# Altium project TTC_PCBEvalBoard.PrjPcb
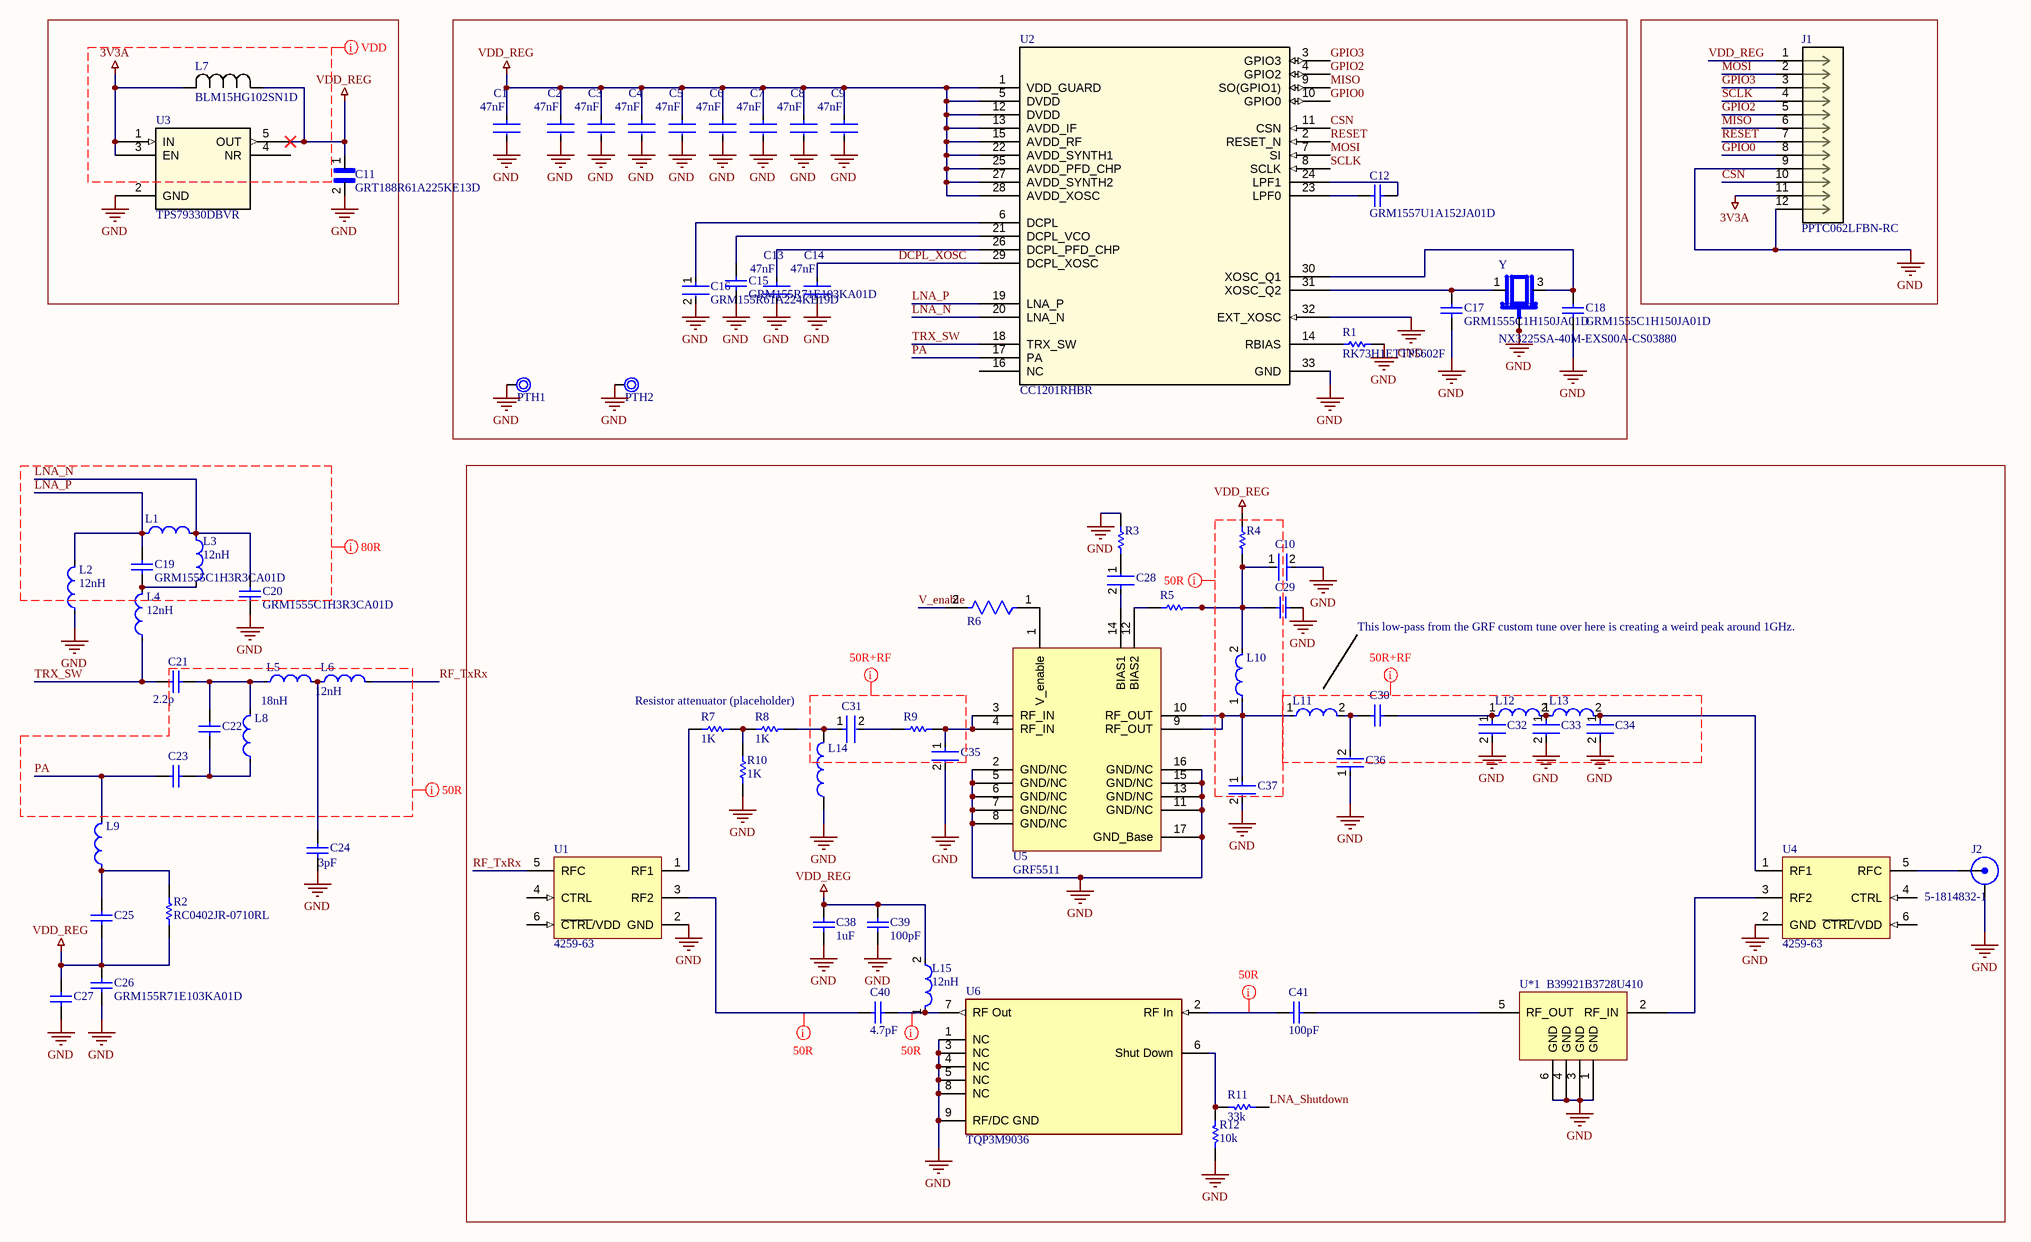
[diagram p0: CC1201EvalBoard.SchDoc]
1 sheet, 80 parts. Net scope: global (net labels, ports and power ports of the same name join across sheets).
Board file: CC1201EvalBoard.PcbDoc

## Sheet CC1201EvalBoard.SchDoc: UVSD CC1201 Evaluation Board
size C; SheetNumber: 1; SheetTotal: 1

### Parts
C1  Capacitance: 47nF  [FP-GRM155-0_05-MFG]  (hidden comment: GRM155R71E473KA88D)
C2  Capacitance: 47nF  [FP-GRM155-0_05-MFG]  (hidden comment: GRM155R71E473KA88D)
C3  Capacitance: 47nF  [FP-GRM155-0_05-MFG]  (hidden comment: GRM155R71E473KA88D)
C4  Capacitance: 47nF  [FP-GRM155-0_05-MFG]  (hidden comment: GRM155R71E473KA88D)
C5  Capacitance: 47nF  [FP-GRM155-0_05-MFG]  (hidden comment: GRM155R71E473KA88D)
C6  Capacitance: 47nF  [FP-GRM155-0_05-MFG]  (hidden comment: GRM155R71E473KA88D)
C7  Capacitance: 47nF  [FP-GRM155-0_05-MFG]  (hidden comment: GRM155R71E473KA88D)
C8  Capacitance: 47nF  [FP-GRM155-0_05-MFG]  (hidden comment: GRM155R71E473KA88D)
C9  Capacitance: 47nF  [FP-GRM155-0_05-MFG]  (hidden comment: GRM155R71E473KA88D)
C10  GRM155R71C104KA88D  [MURATA_C0402]  (value not drawn)
C11  GRT188R61A225KE13D  [CAPC1608X9N]
C12  GRM1557U1A152JA01D  [CAPC1005X55X25ML05T10]
C13  Capacitance: 47nF  [FP-GRM155-0_05-MFG]  (hidden comment: GRM155R71E473KA88D)
C14  Capacitance: 47nF  [FP-GRM155-0_05-MFG]  (hidden comment: GRM155R71E473KA88D)
C15  GRM155R71E103KA01D  [CAPC1005X55X25LL05T10]
C16  GRM155R61A224KE19D  [FP-GRM155-0_05-IPC_C]
C17  GRM1555C1H150JA01D  [CAPC1005X55X25LL05T10]
C18  GRM1555C1H150JA01D  [CAPC1005X55X25LL05T10]
C19  GRM1555C1H3R3CA01D  [CAPC1005X55X25NL5T10]
C20  GRM1555C1H3R3CA01D  [CAPC1005X55X25NL5T10]
C21  value 2.2p  [CAPC1005X55X25ML05T10]  (hidden comment: GRM1555C1H2R2CA01D)
C22  GRM1555C1H1R0BA01D  [CAPC1005X55X25LL05T10]  (value not drawn)
C23  GRM1555C1H150JA01D  [CAPC1005X55X25LL05T10]  (value not drawn)
C24  value 3pF  [CAPC1005X55X25LL05T10]  (hidden comment: GRM1555C1H3R0CA01D)
C25  GRM1555C1H330JA01D  [CAPC1005X55X25ML05T10]  (value not drawn)
C26  GRM155R71E103KA01D  [CAPC1005X55X25LL05T10]
C27  GRM1555C1H101JA01D  [CAPC1005X55X25ML05T10]  (value not drawn)
C28  GRM155R71C104KA88D  [MURATA_C0402]  (value not drawn)
C29  GRM1555C1H101JA01D  [MURATA_C0402]  (value not drawn)
C30  GRM1555C1H101JA01D  [MURATA_C0402]  (value not drawn)
C31  GRM155R70G105KA12D  [MURATA_C0402]  (value not drawn)
C32  GJM1555C1H3R9CB01D  [FP-GJM155-0_05-IPC_C]  (value not drawn)
C33  GJM1555C1H6R8WB01D  [FP-GJM155-0_05-IPC_B]  (value not drawn)
C34  GJM1555C1H3R9CB01D  [FP-GJM155-0_05-IPC_C]  (value not drawn)
C35  GJM1555C1HR30WB01D  [MURATA_C0402]  (value not drawn)
C36  GJM1555C1H4R7CB01D  [MURATA_C0402]  (value not drawn)
C37  GJM1555C1H1R5BB01D  [MURATA_C0402]  (value not drawn)
C38  1uF  [CAPC1005X56X25LL10T15]
C39  100pF  [CAPC1005X56X25LL10T15]
C40  4.7pF  [CAPC1005X56X25LL10T15]
C41  100pF  [CAPC1005X56X25LL10T15]
J1  PPTC062LFBN-RC  [CONN12_878311241_MOL]
J2  5-1814832-1  [TE_5-1814832-1]
L1  LQW15AN15NJ00D  [FP-LQW15AN_00-W0_6-0_1-MFG]  (value not drawn)
L2  value 12nH  [FP-LQW15AN_00-W0_6-0_1-MFG]  (hidden comment: LQW15AN12NJ00D)
L3  value 12nH  [FP-LQW15AN_00-W0_6-0_1-MFG]  (hidden comment: LQW15AN12NJ00D)
L4  value 12nH  [FP-LQW15AN_00-W0_6-0_1-MFG]  (hidden comment: LQW15AN12NJ00D)
L5  Inductance: 18nH  [FP-LQW15AN_00-W0_6-0_1-MFG]  (hidden comment: LQW15AN18NJ00D)
L6  value 12nH  [FP-LQW15AN_00-W0_6-0_1-MFG]  (hidden comment: LQW15AN12NJ00D)
L7  BLM15HG102SN1D  [IND_BLM15_0402_MUR - NO_KEEPOUT]
L8  LQW15AN7N5G00D  [FP-LQW15AN_00-W0_6-0_1-MFG]  (value not drawn)
L9  LQW15AN10NJ00D  [FP-LQW15AN_00-W0_6-0_1-MFG]  (value not drawn)
L10  LQW15AN18NJ00D  [MURATA_L0402_LQW]  (value not drawn)
L11  LQW15AN3N6C10D  [MURATA_L0402_LQW]  (value not drawn)
L12  LQW15AN12NG00D  [FP-LQW15AN_00-W0_6-0_1-MFG]  (value not drawn)
L13  LQW15AN12NG00D  [FP-LQW15AN_00-W0_6-0_1-MFG]  (value not drawn)
L14  LQP15MN8N2B02D  [MURATA_L0402_LQP]  (value not drawn)
L15  12nH  [FP-LQW18AN_80-MFG]
PTH1  PTH  [M3 Mounting Hole]  (value not drawn)
PTH2  PTH  [M3 Mounting Hole]  (value not drawn)
R1  RK73H1ETTP5602F  [RESC1005X40X25NL10T10]
R2  RC0402JR-0710RL  [RESC1005X40X25NL05T10]
R3  RC0402FR-07300RL  [Yageo_0402]  (value not drawn)
R4  RC0402JR-130RL  [Yageo_0402]  (value not drawn)
R5  RC0402FR-07130RL  [Yageo_0402]  (value not drawn)
R6  AC0402FR-07820RL  [Yageo_0402]  (value not drawn)
R7  value 1K  (hidden comment: Resistor)
R8  value 1K  (hidden comment: Resistor)
R9  RC0402FR-077R5L  [Yageo_0402]  (value not drawn)
R10  value 1K  (hidden comment: Resistor)
R11  33k  [RESC1005X40X25ML05T10]
R12  10k  [RESC1005X40X25ML05T10]
U1  4259-63  [PERE-SC-70-6_M]
U2  CC1201RHBR  [RHB32_3P45X3P45_TEX]
U3  TPS79330DBVR  [DBV5_TEX]  (no BOM)
U4  4259-63  [PERE-SC-70-6_M]
U5  GRF5511  [QFN50P300X300X100_HS-17N]
U6  TQP3M9036  [FP-TQP3M9036-MFG]
U*1  B39921B3728U410
Y  NX3225SA-40M-EXS00A-CS03880  [OSCCC320X250X60]

### Blocks framed on the sheet
Resistor attenuator (placeholder): C10 C28-C41 J2 L10-L15 R3-R12 U1 U4-U6 U*1

### Nets
3V3A: J1.11 L7.2 U3.1(IN) U3.3(EN)
GND: C1.2 C2.2 C3.2 C4.2 C5.2 C6.2 C7.2 C8.2 C9.2 C10.2 C11.2 C13.2 C14.2 C15.1 C16.2 C17.1 C18.1 C20.1 C24.1 C26.1 C27.1 C29.2 C32.2 C33.2 C34.2 C35.2 C36.1 C37.2 C38.2 C39.2 J1.9 J1.12 J2.2,3,4,5(GND) L2.1 L14.1 PTH1.1 PTH2.1 R1.2 R3.2 R10.1 R12.1 U1.2(GND) U2.32(EXT_XOSC) U2.33(GND) U3.2(GND) U4.2(GND) U5.2(GND/NC) U5.5(GND/NC) U5.6(GND/NC) U5.7(GND/NC) U5.8(GND/NC) U5.11(GND/NC) U5.13(GND/NC) U5.15(GND/NC) U5.16(GND/NC) U5.17(GND_Base) U6.1(NC) U6.3(NC) U6.4(NC) U6.5(NC) U6.8(NC) U6.9(RF/DC_GND) U*1.1(GND) U*1.3(GND) U*1.4(GND) U*1.6(GND) Y.2(GND) Y.4(GND)
VDD_REG: C1.1 C2.1 C3.1 C4.1 C5.1 C6.1 C7.1 C8.1 C9.1 C11.1 C25.1 C26.2 C27.2 C38.1 C39.1 J1.1 L7.1 L15.2 R2.1 R4.2 U2.1(VDD_GUARD) U2.5(DVDD) U2.12(DVDD) U2.13(AVDD_IF) U2.15(AVDD_RF) U2.22(AVDD_SYNTH1) U2.25(AVDD_PFD_CHP) U2.27(AVDD_SYNTH2) U2.28(AVDD_XOSC) U3.5(OUT)
CSN: J1.10 U2.11(CSN)
DCPL_XOSC: C14.1 U2.29(DCPL_XOSC)
GPIO0: J1.8 U2.10(GPIO0)
GPIO2: J1.5 U2.4(GPIO2)
GPIO3: J1.3 U2.3(GPIO3)
LNA_N: C20.2 L1.2 L3.1 U2.20(LNA_N)
LNA_P: C19.2 L1.1 L2.2 U2.19(LNA_P)
LNA_Shutdown: R11.2
MISO: J1.6 U2.9(SO(GPIO1))
MOSI: J1.2 U2.7(SI)
PA: C23.1 L9.2 U2.17(PA)
RESET: J1.7 U2.2(RESET_N)
RF_TxRx: L6.2 U1.5(RFC)
SCLK: J1.4 U2.8(SCLK)
TRX_SW: C21.1 L4.1 U2.18(TRX_SW)
V_enable: R6.2
NetC10_1: C10.1 C29.1 L10.2 R4.1 R5.2
NetC12_1: C12.1 U2.23(LPF0)
NetC12_2: C12.2 U2.24(LPF1)
NetC13_1: C13.1 U2.26(DCPL_PFD_CHP)
NetC15_2: C15.2 U2.21(DCPL_VCO)
NetC16_1: C16.1 U2.6(DCPL)
NetC17_2: C17.2 U2.31(XOSC_Q2) Y.1
NetC18_2: C18.2 U2.30(XOSC_Q1) Y.3
NetC19_1: C19.1 L3.2 L4.2
NetC21_2: C21.2 C22.2 L5.1 L8.2
NetC22_1: C22.1 C23.2 L8.1
NetC24_2: C24.2 L5.2 L6.1
NetC25_2: C25.2 L9.1 R2.2
NetC28_1: C28.1 R3.1
NetC28_2: C28.2 U5.14(BIAS1)
NetC30_1: C30.1 C36.2 L11.2
NetC30_2: C30.2 C32.1 L12.1
NetC31_1: C31.1 L14.2 R8.2
NetC31_2: C31.2 R9.1
NetC33_1: C33.1 L12.2 L13.1
NetC34_1: C34.1 L13.2 U4.1(RF1)
NetC35_1: C35.1 R9.2 U5.3(RF_IN) U5.4(RF_IN)
NetC37_1: C37.1 L10.1 L11.1 U5.9(RF_OUT) U5.10(RF_OUT)
NetC40_1: C40.1 L15.1 U6.7(RF_Out)
NetC40_2: C40.2 U1.3(RF2)
NetC41_1: C41.1 U*1.5(RF_OUT)
NetC41_2: C41.2 U6.2(RF_In)
NetJ2_1: J2.1 U4.5(RFC)
NetR1_1: R1.1 U2.14(RBIAS)
NetR5_1: R5.1 U5.12(BIAS2)
NetR6_1: R6.1 U5.1(V_enable)
NetR7_1: R7.1 U1.1(RF1)
NetR7_2: R7.2 R8.1 R10.2
NetR11_1: R11.1 R12.2 U6.6(Shut_Down)
NetU4_3: U4.3(RF2) U*1.2(RF_IN)

Not connected (* = marked no-connect by the designer): U1 4(CTRL) 6(~{CTRL}/VDD); U2 16(NC); U3 4(NR); U4 4(CTRL) 6(~{CTRL}/VDD)

### Layout directives
net class 50R: (no net found under the mark), NetC40_1, NetC40_2, NetC41_2, PA
net class 80R: LNA_N, LNA_P
net class VDD: 3V3A
rule Width Constraint [Pref Impedance = 50.00ohms    Min Impedance = 50.00ohms    Max Impedance = 50.00ohms]; net class RF_Main_Line: (no net found under the mark), GND

### Notes on the sheet
- This low-pass from the GRF custom tune over here is creating a weird peak around 1GHz.
- DWG. NO.
- REV.
- SHT.
- THIS DOCUMENT AND THE DATA DISCLOSED HEREIN OR HEREWITH IS THE PROPERTY OF ALTIUM LIMITED AND MAY BE FREELY DISTRIBUTED IN WHOLE. NO RIGHTS ARE RESERVED OR EXPRESS OR IMPLIED WARANTEE GIVEN.
- REVISION
- DESCRIPTION
- DATE
- APPROVED
- ENG:
- APPROVALS
- PROJECT
- DSN:
- CHK:
- REFERENCE DOCUMENTS
- PROJECT REVISION:
- TITLE
- DOCUMENT REVISION:
- DESIGN ITEM:
- BOM:
- FAB DWG:
- PCB DWG:
- ASSY DWG:
- SCALE:
- SIZE
- B
- CAGE CODE
- FILE NAME
- DWG NO.
- SHEET
- OF
- REV

### Library data of the parts
C1-C9 C13 C14 = CMP-2008-04630-5: Chip Multilayer Ceramic Capacitors for General Purpose, 0402, 47000pF, X7R, 15%, 10%, 25V; Depth: 0.5mm; Case/Package: 0402; Tolerance: 10%; REACH SVHC: No SVHC; Termination: SMD/SMT; Number of Pins: 2; Mount: Surface Mount; Radiation Hardening: No; Height: 0.5mm; Min Operating Temperature: -55°C; Max Operating Temperature: 125°C; Thickness: 0.022inch; Length: 1mm; Voltage Rating (DC): 25V; Material: Ceramic; Lead Free: Lead Free; Packaging: Tape and Reel; Dielectric: X7R; Voltage: 25V; Case Code (Metric): 1005; Width: 0.02inch; Case Code (Imperial): 0402; Voltage Rating: 25V; Package Quantity: 1
C10 C28 = CMP-2100-03641-2: CAP CER 0.1UF 16V X7R 0402; Manufacturer: Murata; Standoff Height: 0mm; Tolerance: 10%; Voltage Rating: 16Vdc; Material: Ceramic; Capacitance: 0.10μF; Value: 0.10μF; RoHS: TRUE; Manufacturer Part Number: GRM155R71C104KA88D; Temperature Characteristic: X7R; Octopart: https://octopart.com/grm155r71c104ka88d-murata-196880; Digikey Description: CAP CER 0.1UF 16V X7R 0402; Device Class L3: Ceramic Capacitors; Height: 0.55mm; ComponentLink2Description: Datasheet; Temperature Range Low: -55°C; Ipc Land Pattern Name: CAPC10050X219; ComponentLink2URL: https://search.murata.co.jp/Ceramy/image/img/A01X/G101/ENG/GRM155R71H471KA01-01A.pdf; Device Class L1: Passive Components; Lead Free: yes; Category: Cap; Package: GRM15; Temperature: -55°C to +125°C; Device Class L2: Capacitors; Temperature Range High: +125°C; Mouser Description: 0402 0.1 uF 16V ±10 % Tolerance X7R SMT Multilayer Ceramic Capacitor
C11 = GRT188R61A225KE13D: CAP CER 2.2UF 10V X5R 0603; Package: None; Price: None; Value: *; MP: GRT188R61A225KE13D; Availability: Unavailable
C12 = CMP-2008-04484-1: Manufacturer: Murata; Part Number: GRM1557U1A152JA01D
C15 C26 = CMP-1034-01880-2: Manufacturer: Murata; Part Number: GRM155R71E103KA01D
C16 = CMP-2008-04561-5: CAP CER 0.22UF 10V X5R 0402; Tolerance: 10%; Capacitance: 220nF; Material: Ceramic; Insulation Resistance: 10GR; Package Quantity: 1; Termination: SMD/SMT; Max Operating Temperature: 85°C; Voltage: 10V; REACH SVHC: No SVHC; Thickness: 0.022inch; Mount: Surface Mount; Height: 0.5mm; Length: 1mm; Lead Free: Lead Free; Number of Pins: 2; Case Code (Imperial): 0402; Case/Package: 0402; Min Operating Temperature: -55°C; Packaging: Tape and Reel; Dielectric: X5R; Depth: 0.5mm; Series: GRM; Case Code (Metric): 1005; Radiation Hardening: No; RoHS Compliant: Yes; Voltage Rating (DC): 10V; Voltage Rating: 10V; Dielectric Material: Ceramic; Width: 0.5mm
C17 C18 C23 = CMP-2008-04266-1: Manufacturer: Murata; Part Number: GRM1555C1H150JA01D
C19 C20 = CMP-1034-00264-3: Chip Capacitor, 3.3 pF, +/- 0.25 pF, 50 V, -55 to 125 degC, 0402 (1005 Metric), RoHS, Tape and Reel; Type (Capacitors): C0G; Voltage Rating: 50 V; Capacitance: 3.3 pF; PartNumber: GRM1555C1H3R3CA01D; Package Quantity: 10000; Mounting Technology: Surface Mount; Case Code (Metric): 1005; ComponentLink1Description: Manufacturer URL; PackageDescription: 2-Pin Surface Mount Device, Body 1 x 0.5 mm; Length: 0.039 inch; RoHSCompliant: true; ComponentLink1URL: http://www.murata.com/; Height: 0.5 mm; Max Operating Temperature: 125 degC; REACH SVHC: No SVHC; ComponentLink2URL: http://search.murata.co.jp/Ceramy/image/img/A01X/G101/ENG/GRM1555C1H3R3CA01-01.pdf; Width: 0.02 inch; Mount: Surface Mount; Min Operating Temperature: -55 degC; Case Code (Imperial): 0402; Case/Package: 0402; Radiation Hardening: No; Voltage Rating (DC): 50 V; ComponentLink2Description: Datasheet; Packaging: Tape and Reel; DatasheetVersion: 03/2016
C21 = CMP-2008-03920-1: Manufacturer: Murata; Part Number: GRM1555C1H2R2CA01D
C22 = CMP-2008-03925-1: Manufacturer: Murata; Part Number: GRM1555C1H1R0BA01D
C24 = CMP-2008-04347-1: Manufacturer: Murata; Part Number: GRM1555C1H3R0CA01D
C25 = CMP-2008-03913-1: Manufacturer: Murata; Part Number: GRM1555C1H330JA01D
C27 C29 C30 = CMP-2008-03915-1: Manufacturer: Murata; Part Number: GRM1555C1H101JA01D
C31 = CMP-2008-04585-2: Chip Multilayer Ceramic Capacitors for General Purpose, 0402, 1.0uF, X7R, 15%, 10%, 4V; Capacitance: 1uF; REACH SVHC: No SVHC; Thickness: 0.022inch; Lead Free: Lead Free; Case Code (Imperial): 0402; Weight: 0.000212oz; Case Code (Metric): 1005; Mount: Surface Mount; Height: 0.5mm; Depth: 0.5mm; Tolerance: 10%; Voltage Rating (DC): 4V; Voltage Rating: 4V; Resistor Type: Ceramic; Case/Package: 0402; Max Operating Temperature: 125°C; Packaging: Tape and Reel; Min Operating Temperature: -55°C; Termination: SMD/SMT; Package Quantity: 10000; Voltage: 4V; Dielectric: X7R; Width: 0.02inch; Length: 1mm
C32 C34 = CMP-2008-03853-2: Multi-Layer Ceramic Capacitor 3.9pF C0G  ±0.25pF 0402 Paper T/R; Voltage Rating (DC): 50V; Packaging: Tape and Reel; Case Code (Metric): 1005; Max Operating Temperature: 125°C; Case/Package: 0402; Length: 1mm; Radiation Hardening: No; Min Operating Temperature: -55°C; Case Code (Imperial): 0402; Lead Free: Lead Free; Package Quantity: 1; Dielectric: C0G; Thickness: 0.022inch; Voltage: 50V; Capacitance: 3.9pF; Termination: SMD/SMT; Mount: Surface Mount; Voltage Rating: 50V; Depth: 0.5mm; Width: 0.02inch; Height: 0.5mm
C33 = CMP-06035-049612-1: Multi-Layer Ceramic Capacitor 6.8pF C0G  ±0.05pF 0402 Paper T/R; Voltage Rating (DC): 50V; Dielectric: C0G; Length: 1mm; Capacitance: 6.8pF; Thickness: 500um; Width: 500um
C35 = CMP-2008-03901-2: Multi-Layer Ceramic Capacitor 0.3pF C0G  ±0.05pF 0402 Paper T/R; Voltage Rating (DC): 50V; Packaging: Tape and Reel; Length: 1mm; Min Operating Temperature: -55°C; Case Code (Metric): 1005; Package Quantity: 10000; Termination: SMD/SMT; Height: 0.5mm; Dielectric: C0G; Case Code (Imperial): 0402; Mount: Surface Mount; Max Operating Temperature: 125°C; Thickness: 0.022inch; Radiation Hardening: No; Voltage Rating: 50V; Lead Free: Lead Free; Depth: 0.5mm; Case/Package: 0402; Capacitance: 0.3pF; Width: 0.02inch
C36 = CMP-2008-03859-2: Multi-Layer Ceramic Capacitor 4.7pF C0G  ±0.25pF 0402 Paper T/R; Voltage Rating (DC): 50V; Temperature Coefficient: 30ppm/°C; Case/Package: 0402; Packaging: Tape and Reel; Package Quantity: 10000; Depth: 0.5mm; REACH SVHC: No SVHC; Height: 0.5mm; Lead Free: Lead Free; Number of Pins: 2; Case Code (Imperial): 0402; Width: 0.02inch; Max Operating Temperature: 125°C; Capacitance: 4.7pF; Dielectric: C0G; Lead Pitch: 0.3mm; Voltage Rating: 50V; Min Operating Temperature: -55°C; Thickness: 0.022inch; Voltage: 50V; Radiation Hardening: No; Mount: Surface Mount; Termination: SMD/SMT; Case Code (Metric): 1005; Length: 1mm
C37 = CMP-2008-03820-2: Multi-Layer Ceramic Capacitor 1.5pF C0G  ±0.1pF 0402 Paper T/R; Temperature Coefficient: 30ppm/°C; Voltage Rating: 50V; Depth: 0.5mm; Case Code (Imperial): 0402; Package Quantity: 10000; Length: 1mm; Number of Pins: 2; Max Operating Temperature: 125°C; Mount: Surface Mount; Construction: Flat; Thickness: 0.022inch; Series: GJM; Packaging: Tape and Reel; Radiation Hardening: No; REACH SVHC: No SVHC; Case/Package: 0402; Lead Free: Lead Free; Voltage Rating (DC): 50V; Min Operating Temperature: -55°C; Dielectric: C0G; Termination: SMD/SMT; Width: 0.5mm; Capacitance: 1.5pF; Lead Pitch: 0.3mm; Case Code (Metric): 1005; Voltage: 50V; Height: 0.5mm
C38-C41 = CMP-2008-02462-1: Part Number: 04023A101FAT2A; Manufacturer: AVX Interconnect / Elco
J2 = 11151: CONN SMA JACK STR 50 OHM PCB; Part_Type: Connector; Manufacturer: TE Connectivity; Part_Status: Production; ID: 11151; Updated By: cfar001; Sorted_Value: 0; Voltage_Rating: 500V; Value: 5-1814832-1; Manufacturer Part Number: 5-1814832-1; Manufacturer Part Description: CONN SMA JACK STR 50 OHM PCB; Supplier 1: Digi-Key; Supplier Part Number 1: A97594-ND; RoHS: Yes; Created By: cfar001; Created_Date: 2024-07-04 15:58:01; Updated_Date: 2024-08-12 13:05:25; ComponentLink1Description: Datasheet; ComponentLink1URL: https://mm.digikey.com/Volume0/opasdata/d220001/medias/docus/10/1814832.pdf; ComponentLink2Description: Supplier Part Details; ComponentLink2URL: https://www.digikey.ca/en/products/detail/te-connectivity-amp-connectors/5-1814832-1/1755982; Symbol Ref: 5-1814832-1; MP: 5-1814832-1; Package: None; Availability: Unavailable; Price: None; Sub_Type: SMA
L1 = CMP-2000-06595-2: Wire Wound RF Inductor 15nH ±5% 460mA 0.16Ω 0402 (1005); Test Frequency: 100MHz; DC Resistance (DCR): 160mR; Shielding: Unshielded; Q Factor: 30; Core Material: Air; Self Resonant Frequency: 5GHz; Resistor Type: Wirewound; DC Current: 460mA; Inductance: 15nH; Weight: 2.8E-05oz; Radiation Hardening: No; Depth: 0.7mm; Package Quantity: 10000; Case/Package: 0402; Packaging: Tape and Reel; Length: 1mm; Max DC Current: 460mA; Case Code (Imperial): 0402; Tolerance: 5%; Min Operating Temperature: -55°C; Lead Free: Lead Free; Width: 0.02inch; Case Code (Metric): 1005; Termination: SMD/SMT; Military Standard: Not; Current Rating: 460mA; Height: 0.5mm; Mount: Surface Mount; Max Operating Temperature: 125°C
L2-L4 L6 = CMP-06042-005424-1: Wire Wound RF Inductor 12nH ±5% 500mA 0.14Ω 0402 (1005); Shielding: Unshielded; Self Resonant Frequency: 5.5GHz; Core Material: Air; Test Frequency: 100MHz; Q Factor: 30; DC Resistance (DCR): 140mR; DC Current: 500mA; Case/Package: 0402; Max DC Current: 500mA; Current Rating: 500mA; Mount: Surface Mount; Case Code (Metric): 1005; Military Standard: Not; Inductance: 12nH; Min Operating Temperature: -55°C; Packaging: Tape and Reel; Radiation Hardening: No; Package Quantity: 10000; Max Operating Temperature: 125°C; Resistor Type: Wirewound; Case Code (Imperial): 0402; Tolerance: 5%; Lead Free: Lead Free; Termination: SMD/SMT; Length: 1.1mm; Height: 0.02inch; Depth: 0.7mm; Weight: 2.8E-05oz; Width: 0.5mm
L5 L10 = CMP-06042-006916-1: Wire Wound RF Inductor 18nH ±5% 370mA 0.27Ω 0402 (1005); Q Factor: 25; DC Resistance (DCR): 270mR; Test Frequency: 100MHz; Self Resonant Frequency: 4.5GHz; Core Material: Air; Shielding: Unshielded; Lead Free: Lead Free; Resistor Type: Wirewound; Height: 0.5mm; Width: 0.02inch; Max DC Current: 370mA; Case/Package: 0402; Radiation Hardening: No; Min Operating Temperature: -55°C; Packaging: Tape and Reel; DC Current: 370mA; Tolerance: 5%; Max Operating Temperature: 125°C; Weight: 2.8E-05oz; Current Rating: 370mA; Military Standard: Not; Termination: SMD/SMT; Length: 1mm; Case Code (Metric): 1005; Mount: Surface Mount; Case Code (Imperial): 0402; Package Quantity: 10000; Depth: 0.7mm
  L10: Inductance: 18nH
L7 = BLM15HG102SN1D: No Description Available; Mfr_Name: Murata
L8 = CMP-2000-06597-2: Wire Wound RF Inductor 7.5nH ±2% 570mA 0.13Ω 0402 (1005); Current: 540mA; Core Material: Air; Shielding: Unshielded; Self Resonant Frequency: 6GHz; DC Resistance (DCR): 130mR; Test Frequency: 100MHz; Q Factor: 25; Packaging: Tape and Reel; Min Operating Temperature: -55°C; Inductance: 7.5nH; Width: 0.02inch; Height: 0.5mm; Military Standard: Not; Termination: SMD/SMT; REACH SVHC: No SVHC; Weight: 2.8E-05oz; Inductance Tolerance: 2%; Package Quantity: 10000; Current Rating: 570mA; DC Current: 570mA; Resistor Type: Wirewound; Case Code (Metric): 1005; Case/Package: 0402; Length: 1mm; Mount: Surface Mount; Case Code (Imperial): 0402; Max Operating Temperature: 125°C; Radiation Hardening: No; Lead Free: Lead Free; Tolerance: 2%; Number of Pins: 2; Max DC Current: 570mA; Depth: 0.7mm
L9 = CMP-2000-06594-2: Wire Wound RF Inductor 10nH ±5% 500mA 0.17Ω 0402 (1005); Self Resonant Frequency: 5.5GHz; Q Factor: 25; Core Material: Air; DC Resistance (DCR): 170mR; Test Frequency: 100MHz; Shielding: Unshielded; Packaging: Tape and Reel; Width: 0.02inch; Case Code (Metric): 1005; Case/Package: 0402; Lead Free: Lead Free; Inductance: 10nH; Case Code (Imperial): 0402; Package Quantity: 10000; Military Standard: Not; Max Operating Temperature: 125°C; DC Current: 500mA; Depth: 0.7mm; Height: 0.5mm; Radiation Hardening: No; Tolerance: 5%; Termination: SMD/SMT; Resistor Type: Wirewound; Max DC Current: 500mA; Length: 1mm; Current Rating: 500mA; Mount: Surface Mount; Min Operating Temperature: -55°C; Weight: 2.8E-05oz
L11 = CMP-06042-002461-1: Wire Wound RF Inductor 3.6nH ±0.2nH 900mA 0.04Ω 0402 (1005); Q Factor: 30; Core Material: Air; DC Resistance (DCR): 40mR; Test Frequency: 100MHz; Self Resonant Frequency: 9.5GHz; Shielding: Unshielded; Max DC Current: 900mA; Lead Free: Lead Free; Radiation Hardening: No; Number of Pins: 2; Packaging: Tape and Reel; Case Code (Metric): 1005; Package Quantity: 10000; DC Current: 900mA; REACH SVHC: No SVHC; Max Operating Temperature: 125°C; Military Standard: Not; Case/Package: 0402; Weight: 2.8E-05oz; Case Code (Imperial): 0402; Depth: 0.7mm; Mount: Surface Mount; Min Operating Temperature: -55°C; Inductance: 3.6nH; Current Rating: 900mA; Termination: SMD/SMT; Length: 1mm; Height: 0.5mm; Width: 0.5mm
L12 L13 = CMP-06042-011230-1: Wire Wound RF Inductor 12nH ±2% 500mA 0.14Ω 0402 (1005); Shielding: Unshielded; Core Material: Non-Magnetic; Current: 1A; DC Resistance (DCR): 140mR; Test Frequency: 100MHz; Self Resonant Frequency: 5.5GHz; Weight: 2.8E-05oz; Case Code (Metric): 1005; Height: 0.5mm; Case/Package: 0402; Number of Pins: 2; DC Current: 500mA; Length: 1mm; Depth: 0.7mm; REACH SVHC: No SVHC; Width: 0.02inch; Inductance Tolerance: 2%; Termination: SMD/SMT; Height - Seated (Max): 0.024inch; Radiation Hardening: No; Resistor Type: Wirewound; Package Quantity: 10000; Case Code (Imperial): 0402; Min Operating Temperature: -55°C; Max DC Current: 500mA; Tolerance: 2%; Inductance: 12nH; Military Standard: Not; Current Rating: 500mA; Max Operating Temperature: 125°C; Packaging: Tape and Reel; Mount: Surface Mount; Lead Free: Lead Free
L14 = CMP-03913-14415882-1: 744901082 Fixed Ind 8.2NH 220MA 1.1 Ohm SMD; Test Frequency: 500MHz; DC Resistance (DCR): 540mΩ; Tolerance: 2%; Q Factor: 13; Self Resonant Frequency: 5.5GHz; Shielding: Unshielded; Height: 320µm; Width: 500µm; Termination: SMD/SMT; Height - Seated (Max): 406.4µm; Min Operating Temperature: -40°C; Packaging: Digi-Reel®; REACH SVHC: Unknown; Inductance: 8.2nH; NexarPartId: 14415882; Case Code (Metric): 1005; Current Rating: 220mA; Number of Pins: 2; Weight: 652.039032µg; Max Operating Temperature: 125°C; Mount: Surface Mount; Case Code (Imperial): 0402; Case/Package: 0402; RoHS: Compliant; Composition: Thin Film; Max DC Current: 220mA; Length: 1mm
L15 = CMP-06042-008251-1: Wire Wound RF Inductor 12nH ±5% 1500mA 0.064Ω 0603 (1608); Shielding: Unshielded; Test Frequency: 100MHz; Current Rating: 1.5A; Self Resonant Frequency: 5GHz; DC Resistance (DCR): 64mR; Height - Seated (Max): 0.039inch; Case/Package: 0603; Min Operating Temperature: -55°C; Length: 0.065inch; Width: 0.035inch; Tolerance: 5%; Packaging: Tape and Reel; Max Operating Temperature: 125°C; Mount: Surface Mount; Package Quantity: 4000; Resistor Type: Wirewound; Inductance: 12nH
PTH1 PTH2 = PTH: Plated through-hole for mounting, default M3
R1 = CMP-2002-03927-1: Manufacturer: KOA Speer; Part Number: RK73H1ETTP5602F
R2 = CMP-2002-07917-1: Manufacturer: Yageo / Phycomp; Part Number: RC0402JR-0710RL
R3 = CMP-2002-07009-1: Manufacturer: Yageo / Phycomp; Part Number: RC0402FR-07300RL
R4 = CMP-2002-08060-1: Manufacturer: Yageo / Phycomp; Part Number: RC0402JR-130RL
R5 = CMP-2002-07382-1: Manufacturer: Yageo / Phycomp; Part Number: RC0402FR-07130RL
R6 = CMP-03412-026708-2: RES 820Ω ±1% 0.063W 0402; Resistance: 820R; Voltage Rating: 50V; Temperature Coefficient: 100ppm/°C; Power Rating: 62.5mW; Max Power Dissipation: 63mW; Width: 0.5mm; Length: 0.039inch; Case/Package: 0402; Case Code (Metric): 1005; Case Code (Imperial): 0402; Height: 0.015inch; Features: Moisture Resistant; Tolerance: 1%; Packaging: Tape and Reel; Min Operating Temperature: -55°C; Weight: 2.3E-05oz; Max Operating Temperature: 155°C; Series: AC; Resistor Type: Thick Film; Termination: SMD/SMT; RoHS Compliant: Yes; Number of Terminations: 2
R7 R8 R10 = Resistor: TC1: 0; SimulationGenericComponent: True; TC2: 0
R9 = CMP-2002-07808-1: Manufacturer: Yageo / Phycomp; Part Number: RC0402FR-077R5L
R11 R12 = CMP-2002-03043-1: Part Number: CRCW040210K0FKEDHP; Manufacturer: Vishay Dale
U1 U4 = CMP-2000-05298-1: IC RF Switch SPDT, 50 Ohm, 6-Pin SC70, RoHS, Tape and Reel; Manufacturer: Peregrine Semiconductor; P1dB: 29dBm(typ)IP1dB; Topology: Reflective; Frequency - Upper: 3GHz; Insertion Loss @ Frequency: 0.5dB@2GHz; IIP3: 55dBm(typ); Voltage - Supply: 1.8V~3.3V; Other Names: 1046-1011-24259-63-ND425963PE4259PE4259SCBC-ZPE4259SCBC-Z-ND; Isolation @ Frequency: 20dB@2GHz(typ); Frequency - Lower: 10MHz; Online Catalog: PE4259; Impedance: 50Ohm; RF Type: GeneralPurpose; Series: UltraCMOS; Manufacturer URL: http://www.psemi.com/; Package Description: 6-Pin Small Outline Transistor, Body 2.05 x 1.25 mm, Pitch 0.65 mm; Family: RFSwitches; Packaging: Tape&Reel(TR); Features: Single/DualLineControl; Package / Case: 6-TSSOP,SC-88,SOT-363; Operating Temperature: -40degC~85degC; Circuit: SPDT; Supplier Device Package: SC-70-6; Standard Package: 3,000; Datasheet URL: https://datasheet.ciiva.com/15100/getdatasheetpartid-685660-15100501.pdf; Category: RF/IFandRFID; Datasheet Version: Jan-11; Package Reference: SC-70-6
U2 = CC1201RHBR: No Description Available; Mfr_Name: Texas Instruments; RefDes: RefDes; Type: Type
U3 = TPS79330DBVR: No Description Available; Mfr_Name: Texas Instruments; RefDes: RefDes; Type: Type
U6 = CMP-231850-000003-1: Amplifier, LNA, 0.05- 2.0 GHz, 19.8 dB, 20 dBm, 0.45 dB NF, 2x2 mm
U*1 = B39921B3728U410: Qualcomm SAW Filter. Center freq 915MHz, bandwidth 26MHz
Y = NX3225SA-40M-EXS00A-CS03880: 40MHz Â±10ppm Crystal 10pF 50 Ohms 4-SMD, No Lead; MF: NDK America, Inc.; SnapEDA_Link: https://www.snapeda.com/parts/NX3225SA-40M-EXS00A-CS03880/NDK%20America,%20Inc./view-part/3118804/?ref=snap; Package: SMD-4 NDK America, Inc.; Availability: Unavailable; Price: None; MP: NX3225SA-40M-EXS00A-CS03880; Value: *